# Altium schematic sheet ELC0102 - Green Digits.SchDoc
size C
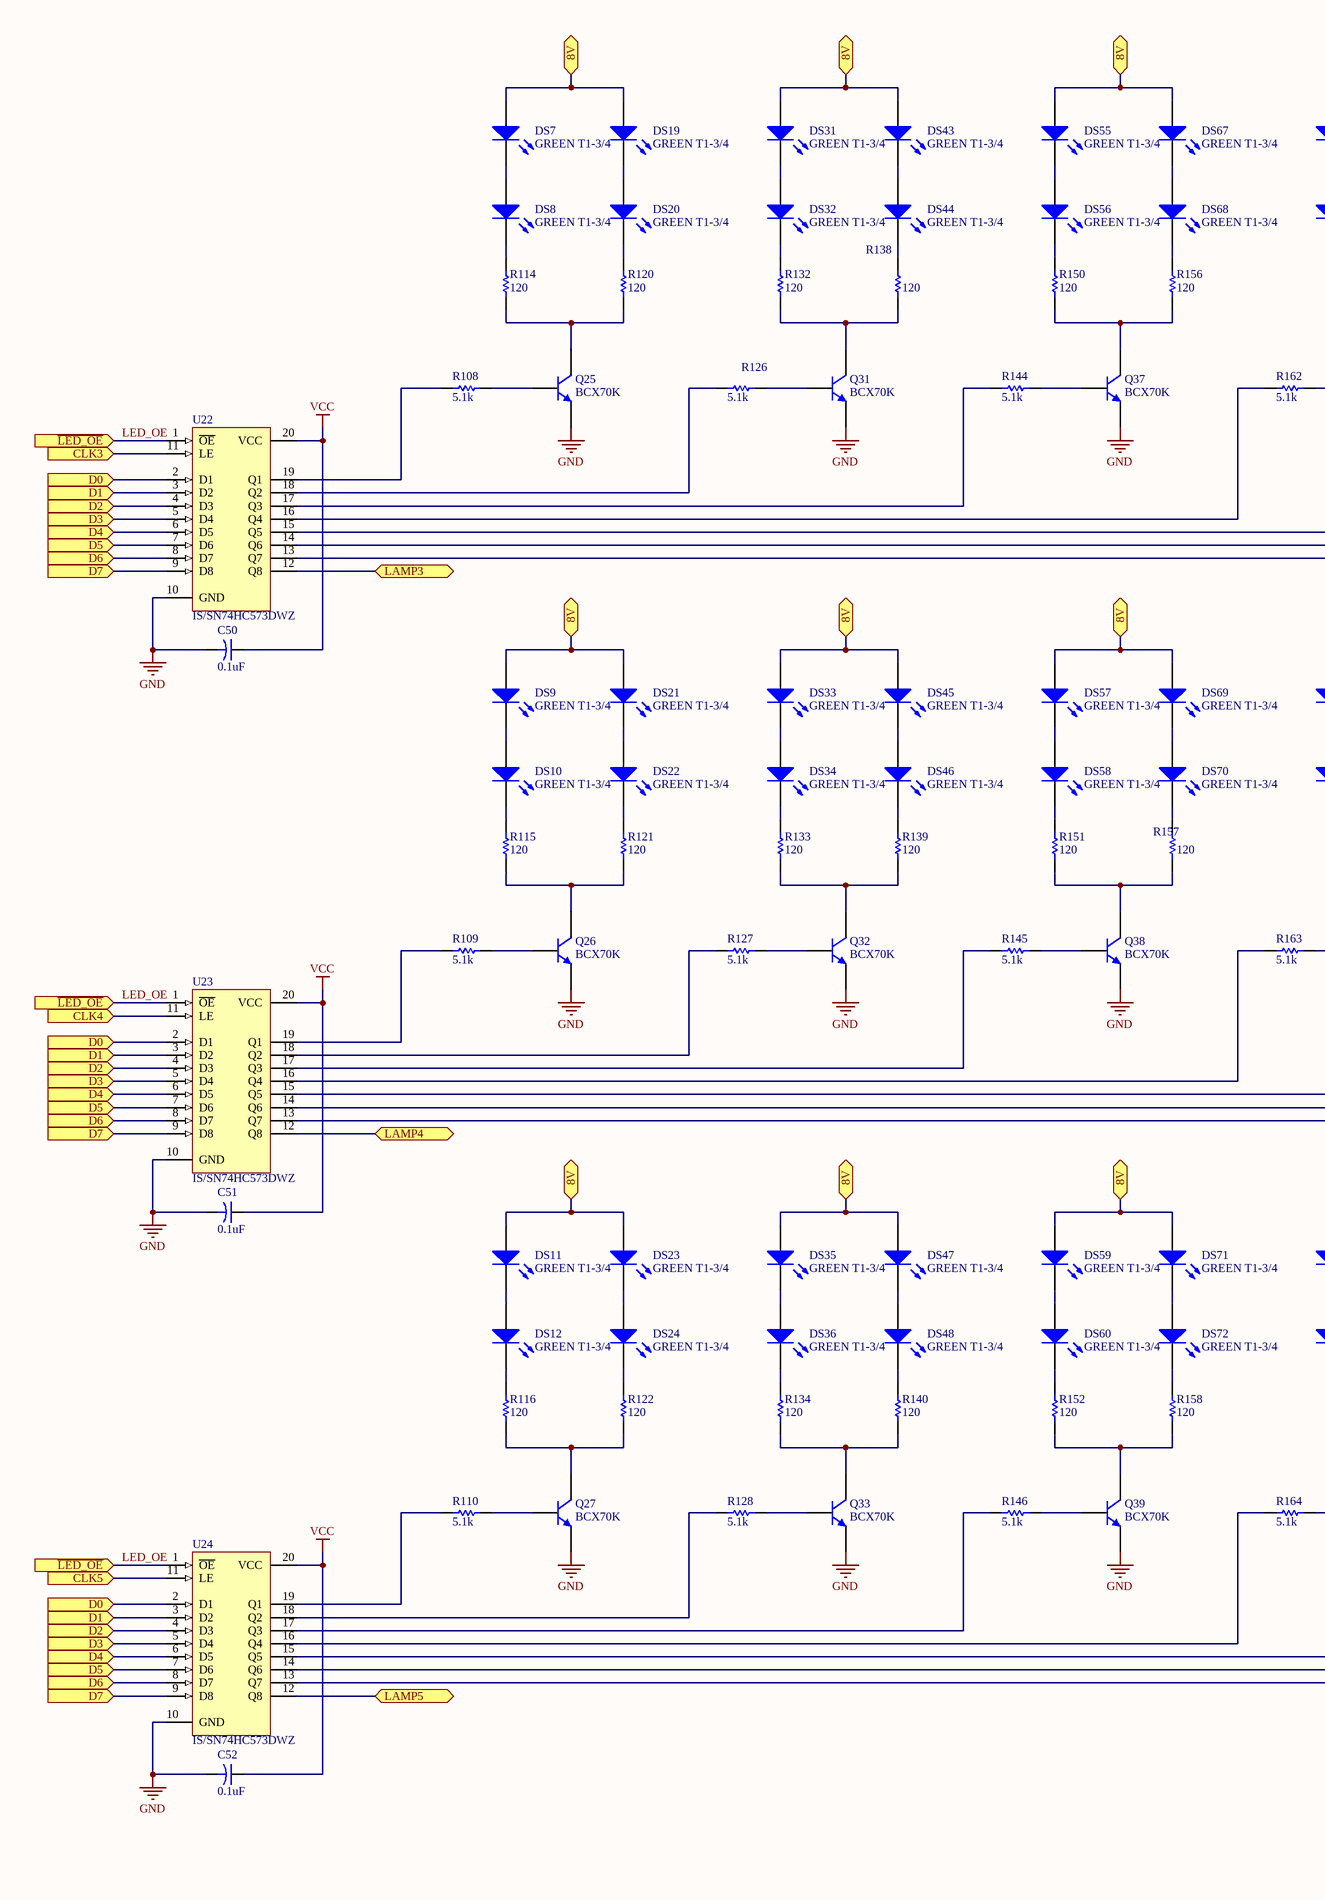
[diagram p0: ELC0102 - Green Digits.SchDoc, left]
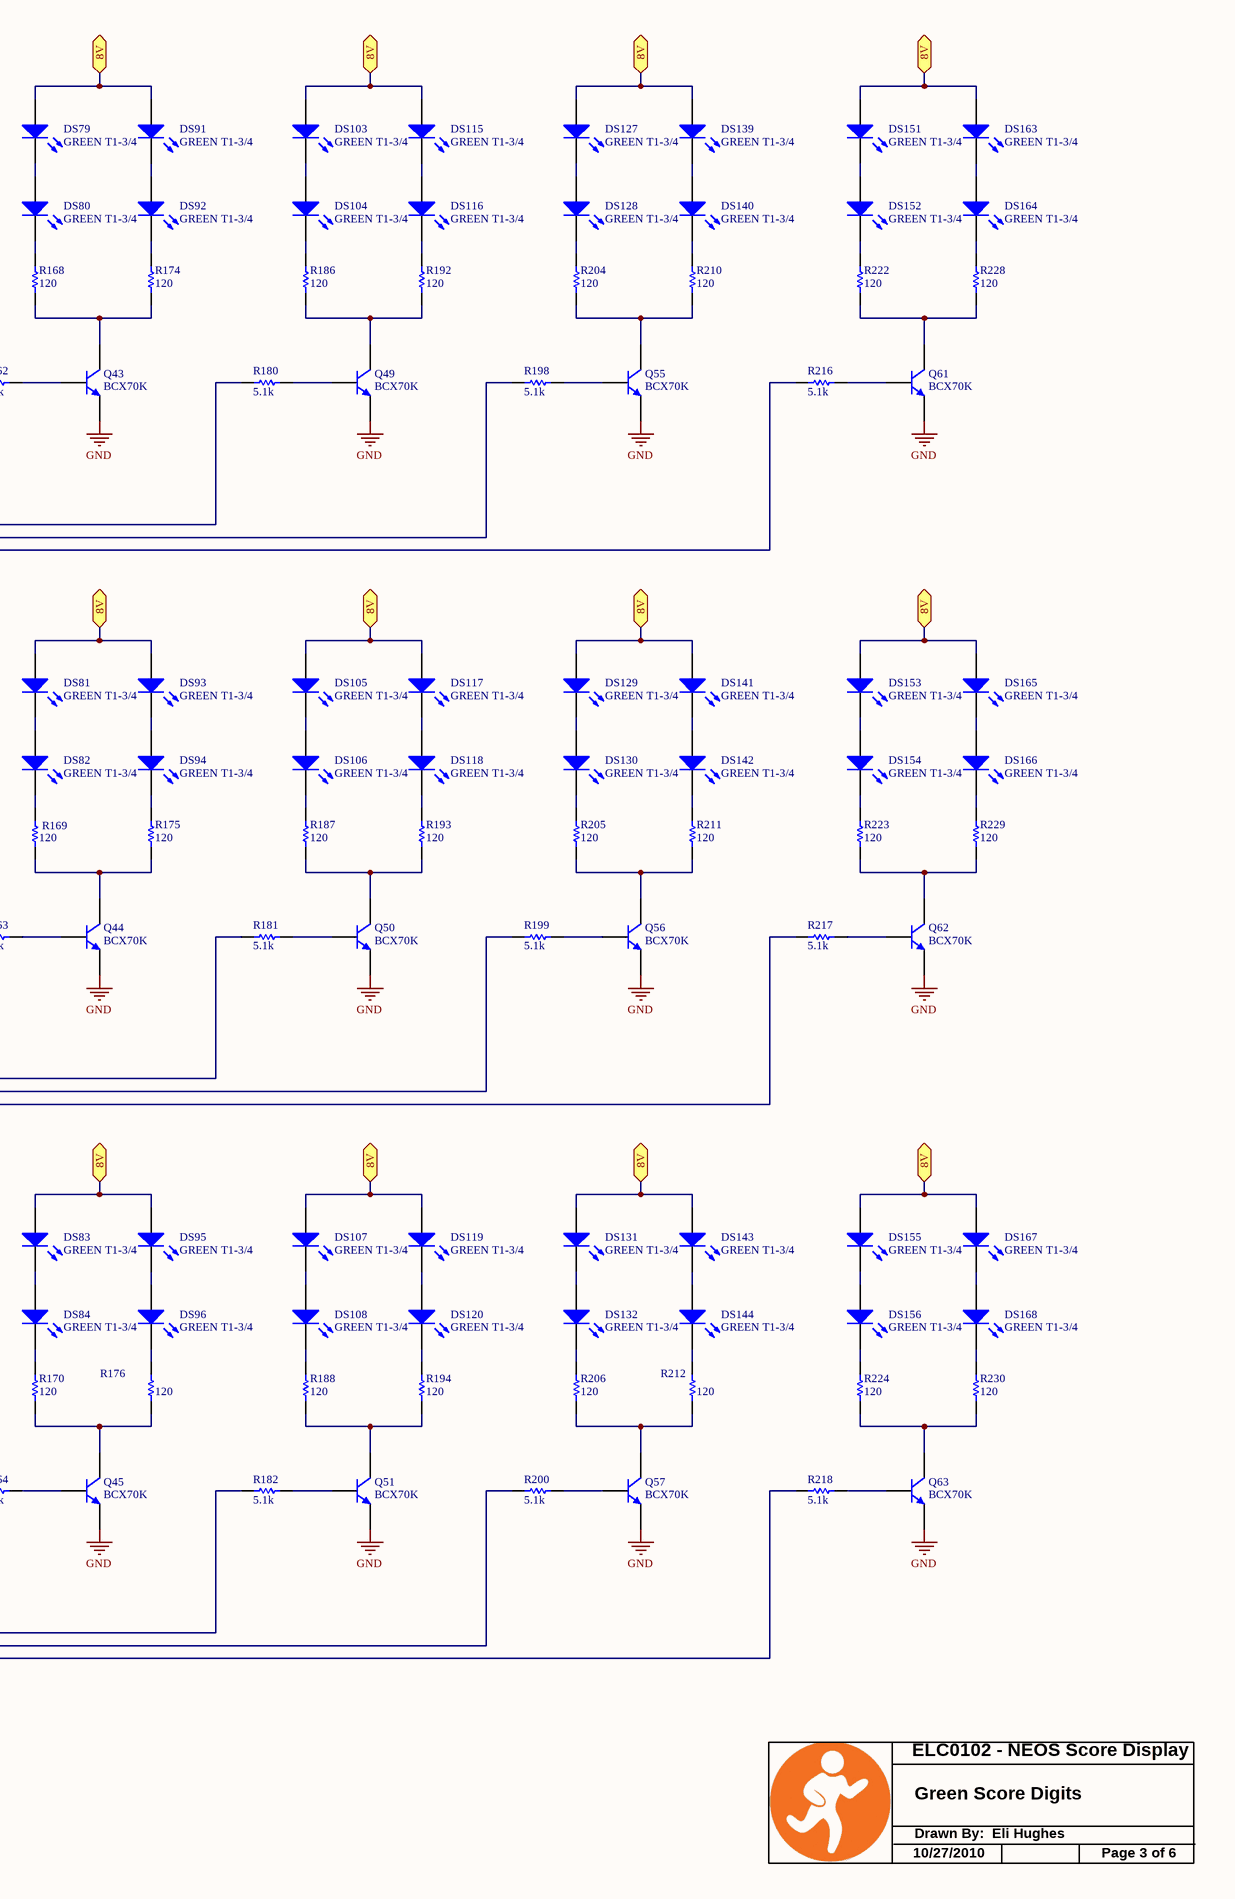
[diagram p1: ELC0102 - Green Digits.SchDoc, right]

## Parts
C50  0.1uF  [C0805]
C51  0.1uF  [C0805]
C52  0.1uF  [C0805]
DS7  GREEN T1-3/4  [LED T1-3/4 Flush]
DS8  GREEN T1-3/4  [LED T1-3/4 Flush]
DS9  GREEN T1-3/4  [LED T1-3/4 Flush]
DS10  GREEN T1-3/4  [LED T1-3/4 Flush]
DS11  GREEN T1-3/4  [LED T1-3/4 Flush]
DS12  GREEN T1-3/4  [LED T1-3/4 Flush]
DS19  GREEN T1-3/4  [LED T1-3/4 Flush]
DS20  GREEN T1-3/4  [LED T1-3/4 Flush]
DS21  GREEN T1-3/4  [LED T1-3/4 Flush]
DS22  GREEN T1-3/4  [LED T1-3/4 Flush]
DS23  GREEN T1-3/4  [LED T1-3/4 Flush]
DS24  GREEN T1-3/4  [LED T1-3/4 Flush]
DS31  GREEN T1-3/4  [LED T1-3/4 Flush]
DS32  GREEN T1-3/4  [LED T1-3/4 Flush]
DS33  GREEN T1-3/4  [LED T1-3/4 Flush]
DS34  GREEN T1-3/4  [LED T1-3/4 Flush]
DS35  GREEN T1-3/4  [LED T1-3/4 Flush]
DS36  GREEN T1-3/4  [LED T1-3/4 Flush]
DS43  GREEN T1-3/4  [LED T1-3/4 Flush]
DS44  GREEN T1-3/4  [LED T1-3/4 Flush]
DS45  GREEN T1-3/4  [LED T1-3/4 Flush]
DS46  GREEN T1-3/4  [LED T1-3/4 Flush]
DS47  GREEN T1-3/4  [LED T1-3/4 Flush]
DS48  GREEN T1-3/4  [LED T1-3/4 Flush]
DS55  GREEN T1-3/4  [LED T1-3/4 Flush]
DS56  GREEN T1-3/4  [LED T1-3/4 Flush]
DS57  GREEN T1-3/4  [LED T1-3/4 Flush]
DS58  GREEN T1-3/4  [LED T1-3/4 Flush]
DS59  GREEN T1-3/4  [LED T1-3/4 Flush]
DS60  GREEN T1-3/4  [LED T1-3/4 Flush]
DS67  GREEN T1-3/4  [LED T1-3/4 Flush]
DS68  GREEN T1-3/4  [LED T1-3/4 Flush]
DS69  GREEN T1-3/4  [LED T1-3/4 Flush]
DS70  GREEN T1-3/4  [LED T1-3/4 Flush]
DS71  GREEN T1-3/4  [LED T1-3/4 Flush]
DS72  GREEN T1-3/4  [LED T1-3/4 Flush]
DS79  GREEN T1-3/4  [LED T1-3/4 Flush]
DS80  GREEN T1-3/4  [LED T1-3/4 Flush]
DS81  GREEN T1-3/4  [LED T1-3/4 Flush]
DS82  GREEN T1-3/4  [LED T1-3/4 Flush]
DS83  GREEN T1-3/4  [LED T1-3/4 Flush]
DS84  GREEN T1-3/4  [LED T1-3/4 Flush]
DS91  GREEN T1-3/4  [LED T1-3/4 Flush]
DS92  GREEN T1-3/4  [LED T1-3/4 Flush]
DS93  GREEN T1-3/4  [LED T1-3/4 Flush]
DS94  GREEN T1-3/4  [LED T1-3/4 Flush]
DS95  GREEN T1-3/4  [LED T1-3/4 Flush]
DS96  GREEN T1-3/4  [LED T1-3/4 Flush]
DS103  GREEN T1-3/4  [LED T1-3/4 Flush]
DS104  GREEN T1-3/4  [LED T1-3/4 Flush]
DS105  GREEN T1-3/4  [LED T1-3/4 Flush]
DS106  GREEN T1-3/4  [LED T1-3/4 Flush]
DS107  GREEN T1-3/4  [LED T1-3/4 Flush]
DS108  GREEN T1-3/4  [LED T1-3/4 Flush]
DS115  GREEN T1-3/4  [LED T1-3/4 Flush]
DS116  GREEN T1-3/4  [LED T1-3/4 Flush]
DS117  GREEN T1-3/4  [LED T1-3/4 Flush]
DS118  GREEN T1-3/4  [LED T1-3/4 Flush]
DS119  GREEN T1-3/4  [LED T1-3/4 Flush]
DS120  GREEN T1-3/4  [LED T1-3/4 Flush]
DS127  GREEN T1-3/4  [LED T1-3/4 Flush]
DS128  GREEN T1-3/4  [LED T1-3/4 Flush]
DS129  GREEN T1-3/4  [LED T1-3/4 Flush]
DS130  GREEN T1-3/4  [LED T1-3/4 Flush]
DS131  GREEN T1-3/4  [LED T1-3/4 Flush]
DS132  GREEN T1-3/4  [LED T1-3/4 Flush]
DS139  GREEN T1-3/4  [LED T1-3/4 Flush]
DS140  GREEN T1-3/4  [LED T1-3/4 Flush]
DS141  GREEN T1-3/4  [LED T1-3/4 Flush]
DS142  GREEN T1-3/4  [LED T1-3/4 Flush]
DS143  GREEN T1-3/4  [LED T1-3/4 Flush]
DS144  GREEN T1-3/4  [LED T1-3/4 Flush]
DS151  GREEN T1-3/4  [LED T1-3/4 Flush]
DS152  GREEN T1-3/4  [LED T1-3/4 Flush]
DS153  GREEN T1-3/4  [LED T1-3/4 Flush]
DS154  GREEN T1-3/4  [LED T1-3/4 Flush]
DS155  GREEN T1-3/4  [LED T1-3/4 Flush]
DS156  GREEN T1-3/4  [LED T1-3/4 Flush]
DS163  GREEN T1-3/4  [LED T1-3/4 Flush]
DS164  GREEN T1-3/4  [LED T1-3/4 Flush]
DS165  GREEN T1-3/4  [LED T1-3/4 Flush]
DS166  GREEN T1-3/4  [LED T1-3/4 Flush]
DS167  GREEN T1-3/4  [LED T1-3/4 Flush]
DS168  GREEN T1-3/4  [LED T1-3/4 Flush]
Q25  BCX70K  [SOT23]
Q26  BCX70K  [SOT23]
Q27  BCX70K  [SOT23]
Q31  BCX70K  [SOT23]
Q32  BCX70K  [SOT23]
Q33  BCX70K  [SOT23]
Q37  BCX70K  [SOT23]
Q38  BCX70K  [SOT23]
Q39  BCX70K  [SOT23]
Q43  BCX70K  [SOT23]
Q44  BCX70K  [SOT23]
Q45  BCX70K  [SOT23]
Q49  BCX70K  [SOT23]
Q50  BCX70K  [SOT23]
Q51  BCX70K  [SOT23]
Q55  BCX70K  [SOT23]
Q56  BCX70K  [SOT23]
Q57  BCX70K  [SOT23]
Q61  BCX70K  [SOT23]
Q62  BCX70K  [SOT23]
Q63  BCX70K  [SOT23]
R108  5.1k  [R0805]
R109  5.1k  [R0805]
R110  5.1k  [R0805]
R114  120  [R1206]
R115  120  [R1206]
R116  120  [R1206]
R120  120  [R1206]
R121  120  [R1206]
R122  120  [R1206]
R126  5.1k  [R0805]
R127  5.1k  [R0805]
R128  5.1k  [R0805]
R132  120  [R1206]
R133  120  [R1206]
R134  120  [R1206]
R138  120  [R1206]
R139  120  [R1206]
R140  120  [R1206]
R144  5.1k  [R0805]
R145  5.1k  [R0805]
R146  5.1k  [R0805]
R150  120  [R1206]
R151  120  [R1206]
R152  120  [R1206]
R156  120  [R1206]
R157  120  [R1206]
R158  120  [R1206]
R162  5.1k  [R0805]
R163  5.1k  [R0805]
R164  5.1k  [R0805]
R168  120  [R1206]
R169  120  [R1206]
R170  120  [R1206]
R174  120  [R1206]
R175  120  [R1206]
R176  120  [R1206]
R180  5.1k  [R0805]
R181  5.1k  [R0805]
R182  5.1k  [R0805]
R186  120  [R1206]
R187  120  [R1206]
R188  120  [R1206]
R192  120  [R1206]
R193  120  [R1206]
R194  120  [R1206]
R198  5.1k  [R0805]
R199  5.1k  [R0805]
R200  5.1k  [R0805]
R204  120  [R1206]
R205  120  [R1206]
R206  120  [R1206]
R210  120  [R1206]
R211  120  [R1206]
R212  120  [R1206]
R216  5.1k  [R0805]
R217  5.1k  [R0805]
R218  5.1k  [R0805]
R222  120  [R1206]
R223  120  [R1206]
R224  120  [R1206]
R228  120  [R1206]
R229  120  [R1206]
R230  120  [R1206]
U22  IS/SN74HC573DWZ  [SOIC300-20]
U23  IS/SN74HC573DWZ  [SOIC300-20]
U24  IS/SN74HC573DWZ  [SOIC300-20]

## Ports
8V, CLK3 (in), CLK4 (in), CLK5 (in), D0 (in), D1 (in), D2 (in), D3 (in), D4 (in), D5 (in), D6 (in), D7 (in), LAMP3, LAMP4, LAMP5, ~{LED_OE} (in)

## Nets
GND: C50.2 C51.2 C52.2 Q25.2(E) Q26.2(E) Q27.2(E) Q31.2(E) Q32.2(E) Q33.2(E) Q37.2(E) Q38.2(E) Q39.2(E) Q43.2(E) Q44.2(E) Q45.2(E) Q49.2(E) Q50.2(E) Q51.2(E) Q55.2(E) Q56.2(E) Q57.2(E) Q61.2(E) Q62.2(E) Q63.2(E) U22.10(GND) U23.10(GND) U24.10(GND)
VCC: C50.1 C51.1 C52.1 U22.20(VCC) U23.20(VCC) U24.20(VCC)
8V: DS7.1(A) DS9.1(A) DS11.1(A) DS19.1(A) DS21.1(A) DS23.1(A) DS31.1(A) DS33.1(A) DS35.1(A) DS43.1(A) DS45.1(A) DS47.1(A) DS55.1(A) DS57.1(A) DS59.1(A) DS67.1(A) DS69.1(A) DS71.1(A) DS79.1(A) DS81.1(A) DS83.1(A) DS91.1(A) DS93.1(A) DS95.1(A) DS103.1(A) DS105.1(A) DS107.1(A) DS115.1(A) DS117.1(A) DS119.1(A) DS127.1(A) DS129.1(A) DS131.1(A) DS139.1(A) DS141.1(A) DS143.1(A) DS151.1(A) DS153.1(A) DS155.1(A) DS163.1(A) DS165.1(A) DS167.1(A) ; port 8V
CLK3: U22.11(LE) ; port CLK3
CLK4: U23.11(LE) ; port CLK4
CLK5: U24.11(LE) ; port CLK5
D0: U22.2(D1) U23.2(D1) U24.2(D1) ; port D0
D1: U22.3(D2) U23.3(D2) U24.3(D2) ; port D1
D2: U22.4(D3) U23.4(D3) U24.4(D3) ; port D2
D3: U22.5(D4) U23.5(D4) U24.5(D4) ; port D3
D4: U22.6(D5) U23.6(D5) U24.6(D5) ; port D4
D5: U22.7(D6) U23.7(D6) U24.7(D6) ; port D5
D6: U22.8(D7) U23.8(D7) U24.8(D7) ; port D6
D7: U22.9(D8) U23.9(D8) U24.9(D8) ; port D7
LAMP3: U22.12(Q8) ; port LAMP3
LAMP4: U23.12(Q8) ; port LAMP4
LAMP5: U24.12(Q8) ; port LAMP5
LED_OE: U22.1(~{OE}) U23.1(~{OE}) U24.1(~{OE}) ; port ~{LED_OE}
NetDS7_2: DS7.2(K) DS8.1(A)
NetDS8_2: DS8.2(K) R114.2
NetDS9_2: DS9.2(K) DS10.1(A)
NetDS10_2: DS10.2(K) R115.2
NetDS11_2: DS11.2(K) DS12.1(A)
NetDS12_2: DS12.2(K) R116.2
NetDS19_2: DS19.2(K) DS20.1(A)
NetDS20_2: DS20.2(K) R120.2
NetDS21_2: DS21.2(K) DS22.1(A)
NetDS22_2: DS22.2(K) R121.2
NetDS23_2: DS23.2(K) DS24.1(A)
NetDS24_2: DS24.2(K) R122.2
NetDS31_2: DS31.2(K) DS32.1(A)
NetDS32_2: DS32.2(K) R132.2
NetDS33_2: DS33.2(K) DS34.1(A)
NetDS34_2: DS34.2(K) R133.2
NetDS35_2: DS35.2(K) DS36.1(A)
NetDS36_2: DS36.2(K) R134.2
NetDS43_2: DS43.2(K) DS44.1(A)
NetDS44_2: DS44.2(K) R138.2
NetDS45_2: DS45.2(K) DS46.1(A)
NetDS46_2: DS46.2(K) R139.2
NetDS47_2: DS47.2(K) DS48.1(A)
NetDS48_2: DS48.2(K) R140.2
NetDS55_2: DS55.2(K) DS56.1(A)
NetDS56_2: DS56.2(K) R150.2
NetDS57_2: DS57.2(K) DS58.1(A)
NetDS58_2: DS58.2(K) R151.2
NetDS59_2: DS59.2(K) DS60.1(A)
NetDS60_2: DS60.2(K) R152.2
NetDS67_2: DS67.2(K) DS68.1(A)
NetDS68_2: DS68.2(K) R156.2
NetDS69_2: DS69.2(K) DS70.1(A)
NetDS70_2: DS70.2(K) R157.2
NetDS71_2: DS71.2(K) DS72.1(A)
NetDS72_2: DS72.2(K) R158.2
NetDS79_2: DS79.2(K) DS80.1(A)
NetDS80_2: DS80.2(K) R168.2
NetDS81_2: DS81.2(K) DS82.1(A)
NetDS82_2: DS82.2(K) R169.2
NetDS83_2: DS83.2(K) DS84.1(A)
NetDS84_2: DS84.2(K) R170.2
NetDS91_2: DS91.2(K) DS92.1(A)
NetDS92_2: DS92.2(K) R174.2
NetDS93_2: DS93.2(K) DS94.1(A)
NetDS94_2: DS94.2(K) R175.2
NetDS95_2: DS95.2(K) DS96.1(A)
NetDS96_2: DS96.2(K) R176.2
NetDS103_2: DS103.2(K) DS104.1(A)
NetDS104_2: DS104.2(K) R186.2
NetDS105_2: DS105.2(K) DS106.1(A)
NetDS106_2: DS106.2(K) R187.2
NetDS107_2: DS107.2(K) DS108.1(A)
NetDS108_2: DS108.2(K) R188.2
NetDS115_2: DS115.2(K) DS116.1(A)
NetDS116_2: DS116.2(K) R192.2
NetDS117_2: DS117.2(K) DS118.1(A)
NetDS118_2: DS118.2(K) R193.2
NetDS119_2: DS119.2(K) DS120.1(A)
NetDS120_2: DS120.2(K) R194.2
NetDS127_2: DS127.2(K) DS128.1(A)
NetDS128_2: DS128.2(K) R204.2
NetDS129_2: DS129.2(K) DS130.1(A)
NetDS130_2: DS130.2(K) R205.2
NetDS131_2: DS131.2(K) DS132.1(A)
NetDS132_2: DS132.2(K) R206.2
NetDS139_2: DS139.2(K) DS140.1(A)
NetDS140_2: DS140.2(K) R210.2
NetDS141_2: DS141.2(K) DS142.1(A)
NetDS142_2: DS142.2(K) R211.2
NetDS143_2: DS143.2(K) DS144.1(A)
NetDS144_2: DS144.2(K) R212.2
NetDS151_2: DS151.2(K) DS152.1(A)
NetDS152_2: DS152.2(K) R222.2
NetDS153_2: DS153.2(K) DS154.1(A)
NetDS154_2: DS154.2(K) R223.2
NetDS155_2: DS155.2(K) DS156.1(A)
NetDS156_2: DS156.2(K) R224.2
NetDS163_2: DS163.2(K) DS164.1(A)
NetDS164_2: DS164.2(K) R228.2
NetDS165_2: DS165.2(K) DS166.1(A)
NetDS166_2: DS166.2(K) R229.2
NetDS167_2: DS167.2(K) DS168.1(A)
NetDS168_2: DS168.2(K) R230.2
NetQ25_1: Q25.1(B) R108.2
NetQ25_3: Q25.3(C) R114.1 R120.1
NetQ26_1: Q26.1(B) R109.2
NetQ26_3: Q26.3(C) R115.1 R121.1
NetQ27_1: Q27.1(B) R110.2
NetQ27_3: Q27.3(C) R116.1 R122.1
NetQ31_1: Q31.1(B) R126.2
NetQ31_3: Q31.3(C) R132.1 R138.1
NetQ32_1: Q32.1(B) R127.2
NetQ32_3: Q32.3(C) R133.1 R139.1
NetQ33_1: Q33.1(B) R128.2
NetQ33_3: Q33.3(C) R134.1 R140.1
NetQ37_1: Q37.1(B) R144.2
NetQ37_3: Q37.3(C) R150.1 R156.1
NetQ38_1: Q38.1(B) R145.2
NetQ38_3: Q38.3(C) R151.1 R157.1
NetQ39_1: Q39.1(B) R146.2
NetQ39_3: Q39.3(C) R152.1 R158.1
NetQ43_1: Q43.1(B) R162.2
NetQ43_3: Q43.3(C) R168.1 R174.1
NetQ44_1: Q44.1(B) R163.2
NetQ44_3: Q44.3(C) R169.1 R175.1
NetQ45_1: Q45.1(B) R164.2
NetQ45_3: Q45.3(C) R170.1 R176.1
NetQ49_1: Q49.1(B) R180.2
NetQ49_3: Q49.3(C) R186.1 R192.1
NetQ50_1: Q50.1(B) R181.2
NetQ50_3: Q50.3(C) R187.1 R193.1
NetQ51_1: Q51.1(B) R182.2
NetQ51_3: Q51.3(C) R188.1 R194.1
NetQ55_1: Q55.1(B) R198.2
NetQ55_3: Q55.3(C) R204.1 R210.1
NetQ56_1: Q56.1(B) R199.2
NetQ56_3: Q56.3(C) R205.1 R211.1
NetQ57_1: Q57.1(B) R200.2
NetQ57_3: Q57.3(C) R206.1 R212.1
NetQ61_1: Q61.1(B) R216.2
NetQ61_3: Q61.3(C) R222.1 R228.1
NetQ62_1: Q62.1(B) R217.2
NetQ62_3: Q62.3(C) R223.1 R229.1
NetQ63_1: Q63.1(B) R218.2
NetQ63_3: Q63.3(C) R224.1 R230.1
NetR108_1: R108.1 U22.19(Q1)
NetR109_1: R109.1 U23.19(Q1)
NetR110_1: R110.1 U24.19(Q1)
NetR126_1: R126.1 U22.18(Q2)
NetR127_1: R127.1 U23.18(Q2)
NetR128_1: R128.1 U24.18(Q2)
NetR144_1: R144.1 U22.17(Q3)
NetR145_1: R145.1 U23.17(Q3)
NetR146_1: R146.1 U24.17(Q3)
NetR162_1: R162.1 U22.16(Q4)
NetR163_1: R163.1 U23.16(Q4)
NetR164_1: R164.1 U24.16(Q4)
NetR180_1: R180.1 U22.15(Q5)
NetR181_1: R181.1 U23.15(Q5)
NetR182_1: R182.1 U24.15(Q5)
NetR198_1: R198.1 U22.14(Q6)
NetR199_1: R199.1 U23.14(Q6)
NetR200_1: R200.1 U24.14(Q6)
NetR216_1: R216.1 U22.13(Q7)
NetR217_1: R217.1 U23.13(Q7)
NetR218_1: R218.1 U24.13(Q7)

## Notes on the sheet
- ELC0102 - NEOS Score Display
- Green Score Digits
- 10/27/2010
- Drawn By:  Eli Hughes
- Page 3 of 6

## Library data of the parts
C50-C52 = CS/C0805C104K5RACK: CAP .10UF 50V CERAMIC X7R 0805; Manufacturer: Kemet; Manufacturer Part Number: C0805C104K5RACTU; Source Part Number: 399-1170-2-ND; Capacitance: 0.1µF; Tolerance: ±10%; ROHS Certificate: Lead free / RoHS compliant; Source: Digikey; Value: 0.1uF; Supplier 1: Digi-Key; RoHS: RoHS Compliant; Category: Capacitors; Stock 1: 10120790; Pricing 1: 10=0.105, 100=0.0378, 250=0.02732, 500=0.02016, 1000=0.01365 (USD); Voltage - Rated: 50V; Temperature Coefficient: X7R; Mounting Type: Surface Mount, MLCC; Operating Temperature: -55°C ~ 125°C; Features: -; Applications: General Purpose; Ratings: -; Package / Case: 0805 (2012 Metric); Size / Dimension: 0.079" L x 0.049" W (2.00mm x 1.25mm); Lead Spacing: -; Thickness: 0.90mm; Packaging: Cut Tape (CT); Lead Style: -; ComponentLink1URL: http://www.kemet.com/datasheets&C0805C104K5RACTU; ComponentLink1Description: http://www.kemet.com/datasheets&C0805C104K5RACTU; Supplier Part Number 1: 399-1170-1-ND
DS7-DS12 DS19-DS24 DS31-DS36 DS43-DS48 DS55-DS60 DS67-DS72 DS79-DS84 DS91-DS96 DS103-DS108 DS115-DS120 DS127-DS132 DS139-DS144 DS151-DS156 DS163-DS168 = LGCOVLFG3C7Z: Optek LED Green/Clear High Brightness T1-3/4; Source Part Number: 365-1181-ND; Description: LED 525NM ROUND GREEN 5MM; Current - Test: 20mA; Wavelength - Dominant: 525nm; Wavelength - Peak: 521nm; Millicandela Rating: 5200mcd; Voltage - Forward (Vf) Typ: 3.4V; Lens Type: Clear; Lens Style/Size: Round, 5mm, T-1 3/4; Viewing Angle: 30°; Manufacturer: OPTEK; Manufacturer Part Number: OVLFG3C7; ROHS Certificate: Lead free / RoHS compliant; Source: Digikey; Value: OVLFG3C7; Supplier 1: Digi-Key; RoHS: RoHS Compliant; Category: Optoelectronics; Stock 1: 2662; Pricing 1: 1=0.58, 100=0.3, 500=0.29, 2500=0.28, 25000=0.27 (USD); Color: Green; Luminous Flux @ Current - Test: -; Package / Case: Radial - 2 Lead; Mounting Type: Through Hole; Packaging: Bulk; ComponentLink1URL: http://media.digikey.com/pdf/Data%20Sheets/Optek%20PDFs/OVLFB3C7.pdf; ComponentLink1Description: http://media.digikey.com/pdf/Data%20Sheets/Optek%20PDFs/OVLFB3C7.pdf; Supplier Part Number 1: 365-1181-ND
Q25-Q27 Q31-Q33 Q37-Q39 Q43-Q45 Q49-Q51 Q55-Q57 Q61-Q63 = QS/BCX70K00Z: NPN SOT23 Silicon Planar Small Signal Transistor; Manufacturer: Fairchild Semiconductor; Source Part Number: BCX70K-ND; Description: TRANS NPN AF 45V SOT-23; Current - Collector (Ic) (Max): 100mA; Voltage - Collector Emitter Breakdown (Max): 45V; Vce Saturation (Max) @ Ib, Ic: 550mV @ 1.25mA, 50mA; DC Current Gain (hFE) (Min) @ Ic, Vce: 380 @ 2mA, 5V; Power - Max: 330mW; Frequency - Transition: 250MHz; Manufacturer Part Number: BCX70K; ROHS Certificate: Lead free / RoHS compliant; Source: Digikey; Value: BCX70K; Supplier 1: Digi-Key; RoHS: RoHS Compliant; Category: Discrete Semiconductor Products; Stock 1: 69796; Pricing 1: 1=0.5, 10=0.331, 100=0.144, 500=0.06624, 1000=0.0468 (USD); Transistor Type: NPN; Current - Collector Cutoff (Max): -; Mounting Type: Surface Mount; Package / Case: SOT-23-3, TO-236-3, Micro3™, SSD3, SST3; Packaging: Cut Tape (CT); Supplier Device Package: SOT-23; ComponentLink1URL: http://www.infineon.com/dgdl/bcw60_bcx70.pdf?folderId=db3a304412b407950112b43286c05890&fileId=db3a304412b407950112b43287355891; ComponentLink1Description: http://www.infineon.com/dgdl/bcw60_bcx70.pdf?folderId=db3a304412b407950112b43286c05890&fileId=db3a304412b407950112b43287355891; Supplier Part Number 1: BCX70KINCT-ND
R108-R110 R126-R128 R144-R146 R162-R164 R180-R182 R198-R200 R216-R218 = ERJ-6ENF5101V: RES 5.10K OHM 1/8W 1% 0805 SMD; Manufacturer: Panasonic - ECG; Power (Watts): 0.125W, 1/8W; Temperature Coefficient: ±100ppm/°C; ComponentLink1Description: http://industrial.panasonic.com/www-cgi/jvcr13pz.cgi?E+PZ+3+AOA0002+ERJ6ENF5101V+7+WW; ComponentLink1URL: http://industrial.panasonic.com/www-cgi/jvcr13pz.cgi?E+PZ+3+AOA0002+ERJ6ENF5101V+7+WW; Value: 5.1k; Supplier 1: Digi-Key; Manufacturer Part Number: ERJ-6ENF5101V; RoHS: RoHS Compliant; Category: Resistors; Stock 1: 32293; Pricing 1: 1=0.07, 50=0.0276, 100=0.021, 250=0.0156, 500=0.01152, 1000=0.00768 (USD); Resistance In Ohms: 5.10K; Composition: Thick Film; Features: -; Tolerance: ±1%; Case: 0805 (2012 metric); Size / Dimension: 0.079" L x 0.049" W (2.00mm x 1.25mm); Height: 0.024" (0.60mm); Lead Style: Surface Mount (SMD - SMT); Packaging: Digi-Reel®; Supplier Part Number 1: P5.10KCDKR-ND
R114-R116 R120-R122 R132-R134 R138-R140 R150-R152 R156-R158 R168-R170 R174-R176 R186-R188 R192-R194 R204-R206 R210-R212 R222-R224 R228-R230 = ERJ-8ENF1200V: RES 120 OHM 1/4W 1% 1206 SMD; Manufacturer: Panasonic - ECG; Power (Watts): 0.25W, 1/4W; Temperature Coefficient: ±100ppm/°C; Value: 120; Supplier 1: Digi-Key; Manufacturer Part Number: ERJ-8ENF1200V; RoHS: RoHS Compliant; Category: Resistors; Stock 1: 58342; Pricing 1: 1=0.1, 50=0.0368, 100=0.028, 250=0.0208, 500=0.01536, 1000=0.01024 (USD); Resistance In Ohms: 120; Composition: Thick Film; Features: -; Tolerance: ±1%; Case: 1206 (3216 metric); Size / Dimension: 0.126" L x 0.063" W (3.20mm x 1.60mm); Height: 0.024" (0.60mm); Lead Style: Surface Mount (SMD - SMT); Packaging: Cut Tape (CT); ComponentLink1URL: http://industrial.panasonic.com/www-cgi/jvcr13pz.cgi?E+PZ+3+AOA0002+ERJ8ENF1200V+7+WW; ComponentLink1Description: http://industrial.panasonic.com/www-cgi/jvcr13pz.cgi?E+PZ+3+AOA0002+ERJ8ENF1200V+7+WW; Supplier Part Number 1: P120FCT-ND
U22-U24 = IS/SN74HC573DWZ: Octal D-Type Transparent Latch with 3-State Outputs; Manufacturer: NXP Semiconductors; Manufacturer Part Number: 74HC573D-T; Source Part Number: 568-1477-2-ND; Value: 74HC573D-T; Description: IC LATCH OCTAL D 3STATE 20SOIC; Circuit: 8:8; Output Type: Tri-State; Voltage - Supply: 2 V ~ 6 V; Independent Circuits: 1; Delay Time - Propagation: 14ns; Current - Output High, Low: 7.8mA, 7.8mA; ROHS Certificate: Lead free / RoHS compliant; Source: Digikey; Supplier 1: Digi-Key; RoHS: RoHS Compliant; Category: Integrated Circuits (ICs); Stock 1: 46803; Pricing 1: 1=0.84, 25=0.646, 100=0.57, 250=0.494, 500=0.418 (USD); Logic Type: D-Type Transparent Latch; Operating Temperature: -40°C ~ 125°C; Mounting Type: Surface Mount; Package / Case: 20-SOIC (0.300", 7.50mm Width); Packaging: Cut Tape (CT); Supplier Device Package: 20-SOIC; ComponentLink1URL: http://www.nxp.com/documents/data_sheet/74HC_HCT573.pdf; ComponentLink1Description: http://www.nxp.com/documents/data_sheet/74HC_HCT573.pdf; Supplier Part Number 1: 568-1477-1-ND